# Altium schematic sheet FlexiCan.SchDoc
size A1; SheetNumber: 1; SheetTotal: 1
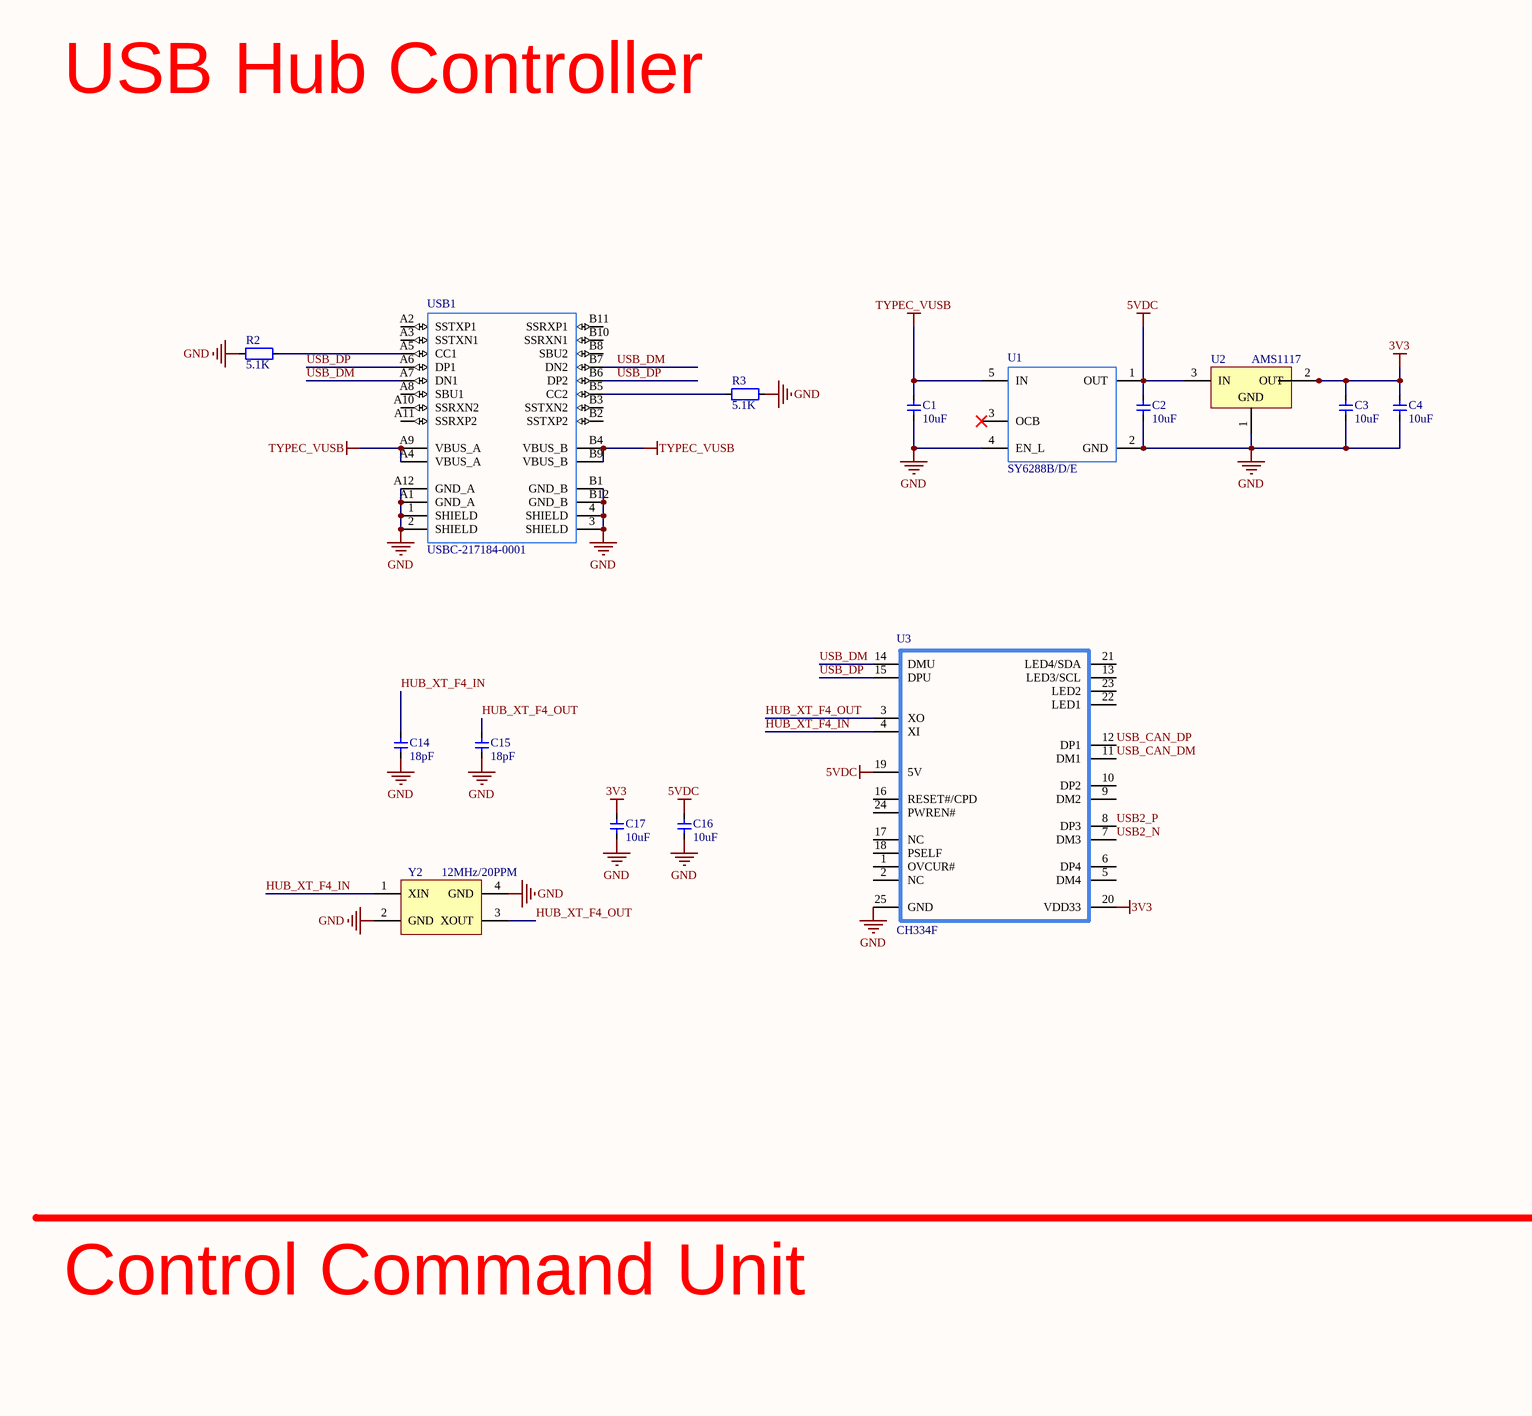
[diagram p0: FlexiCan.SchDoc, top left]
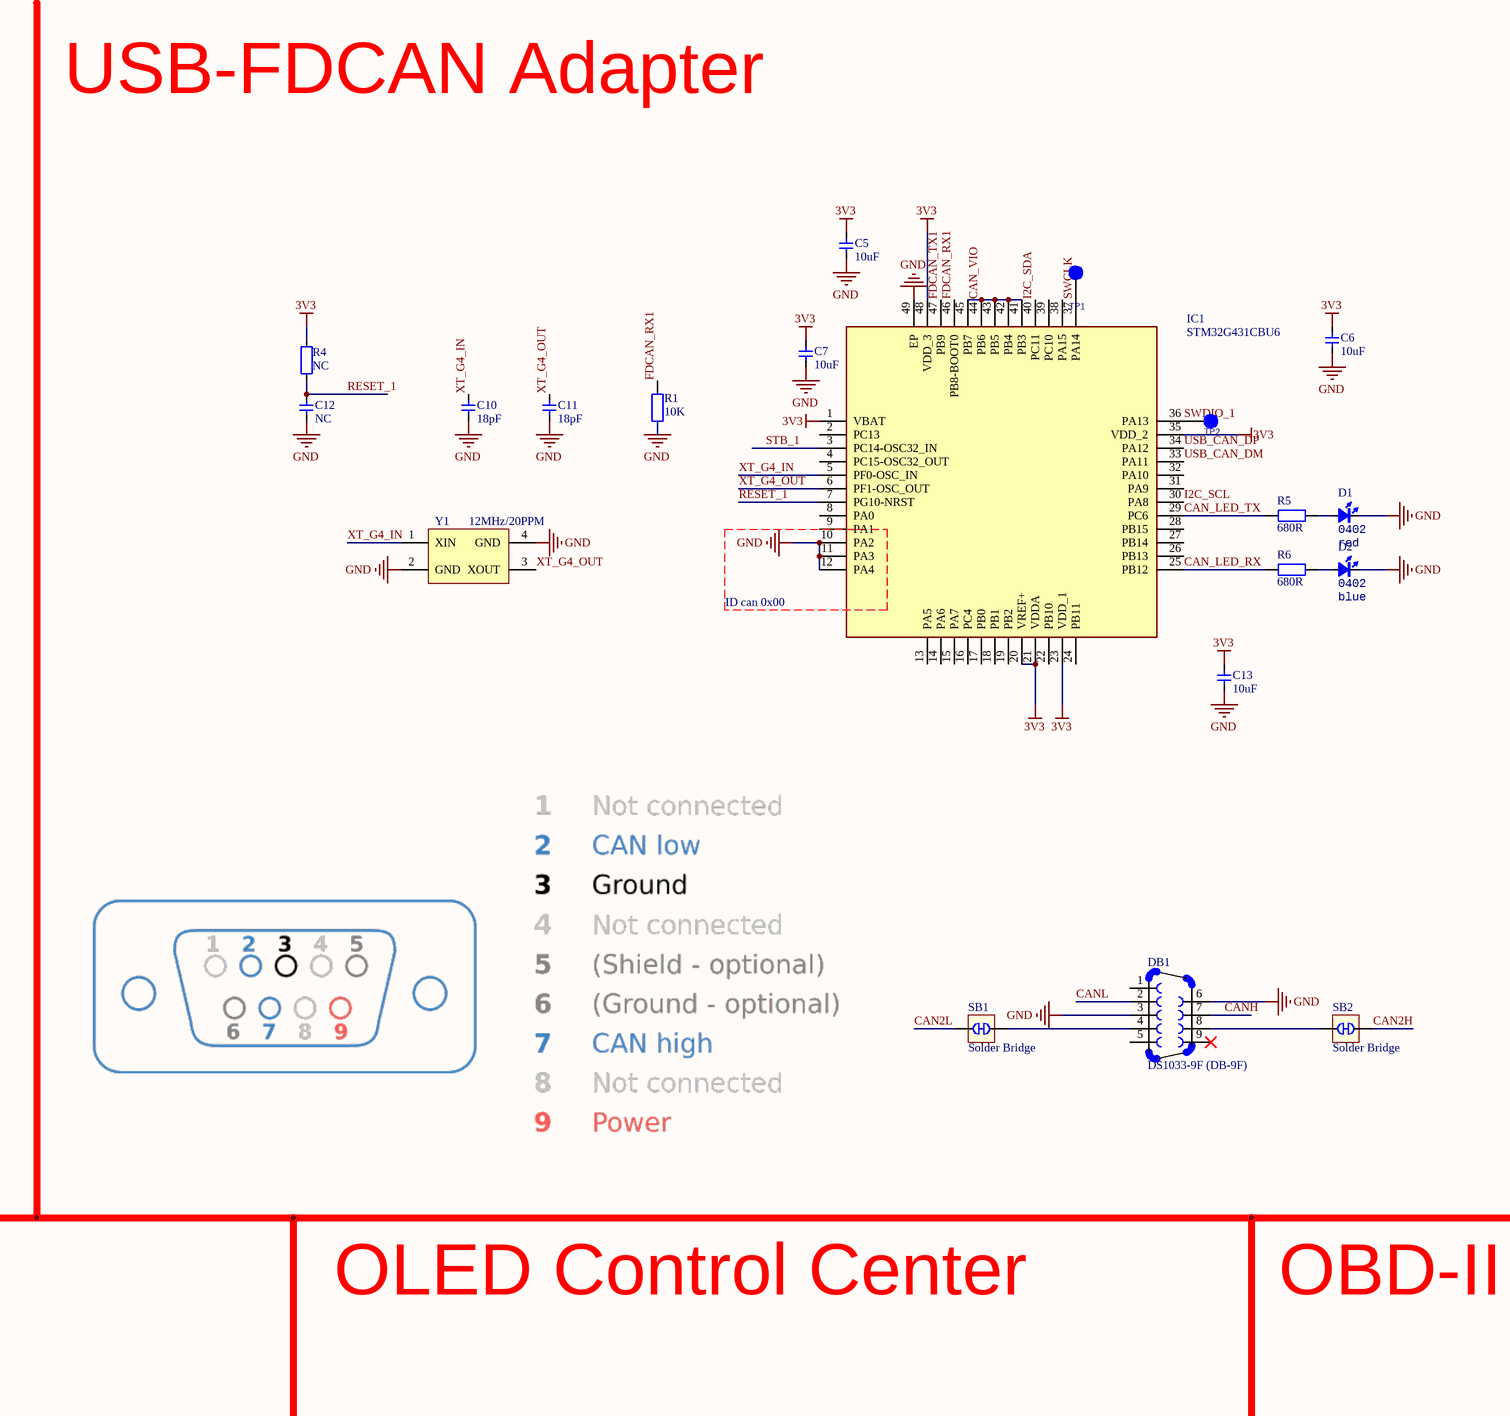
[diagram p1: FlexiCan.SchDoc, top middle]
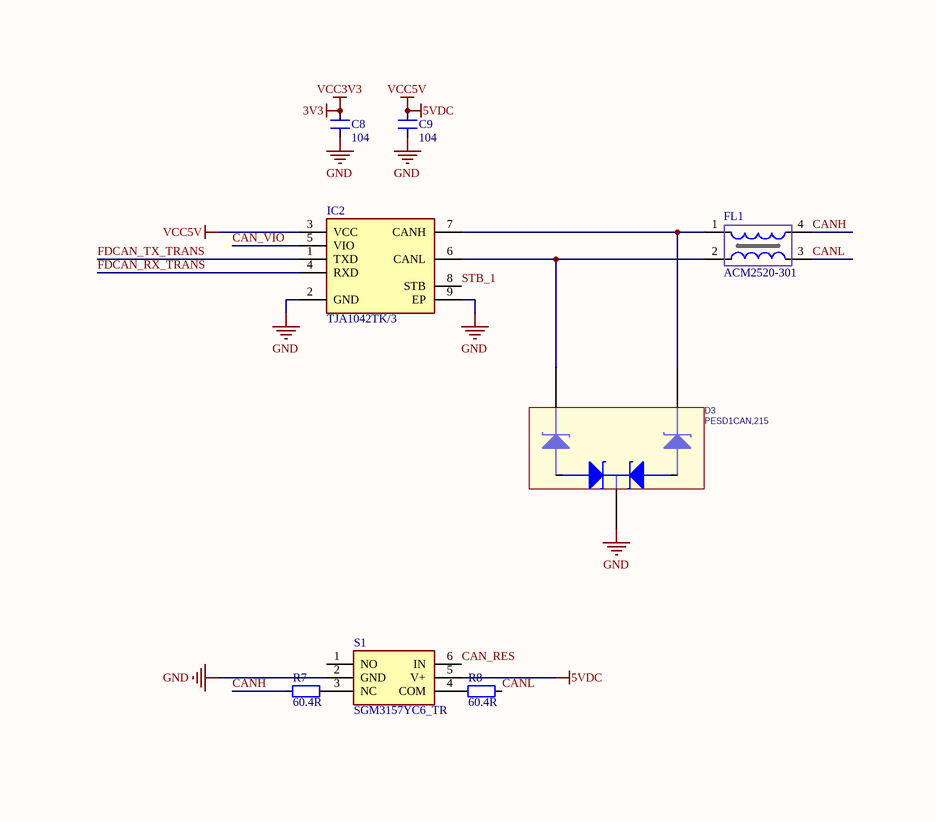
[diagram p2: FlexiCan.SchDoc, top right]
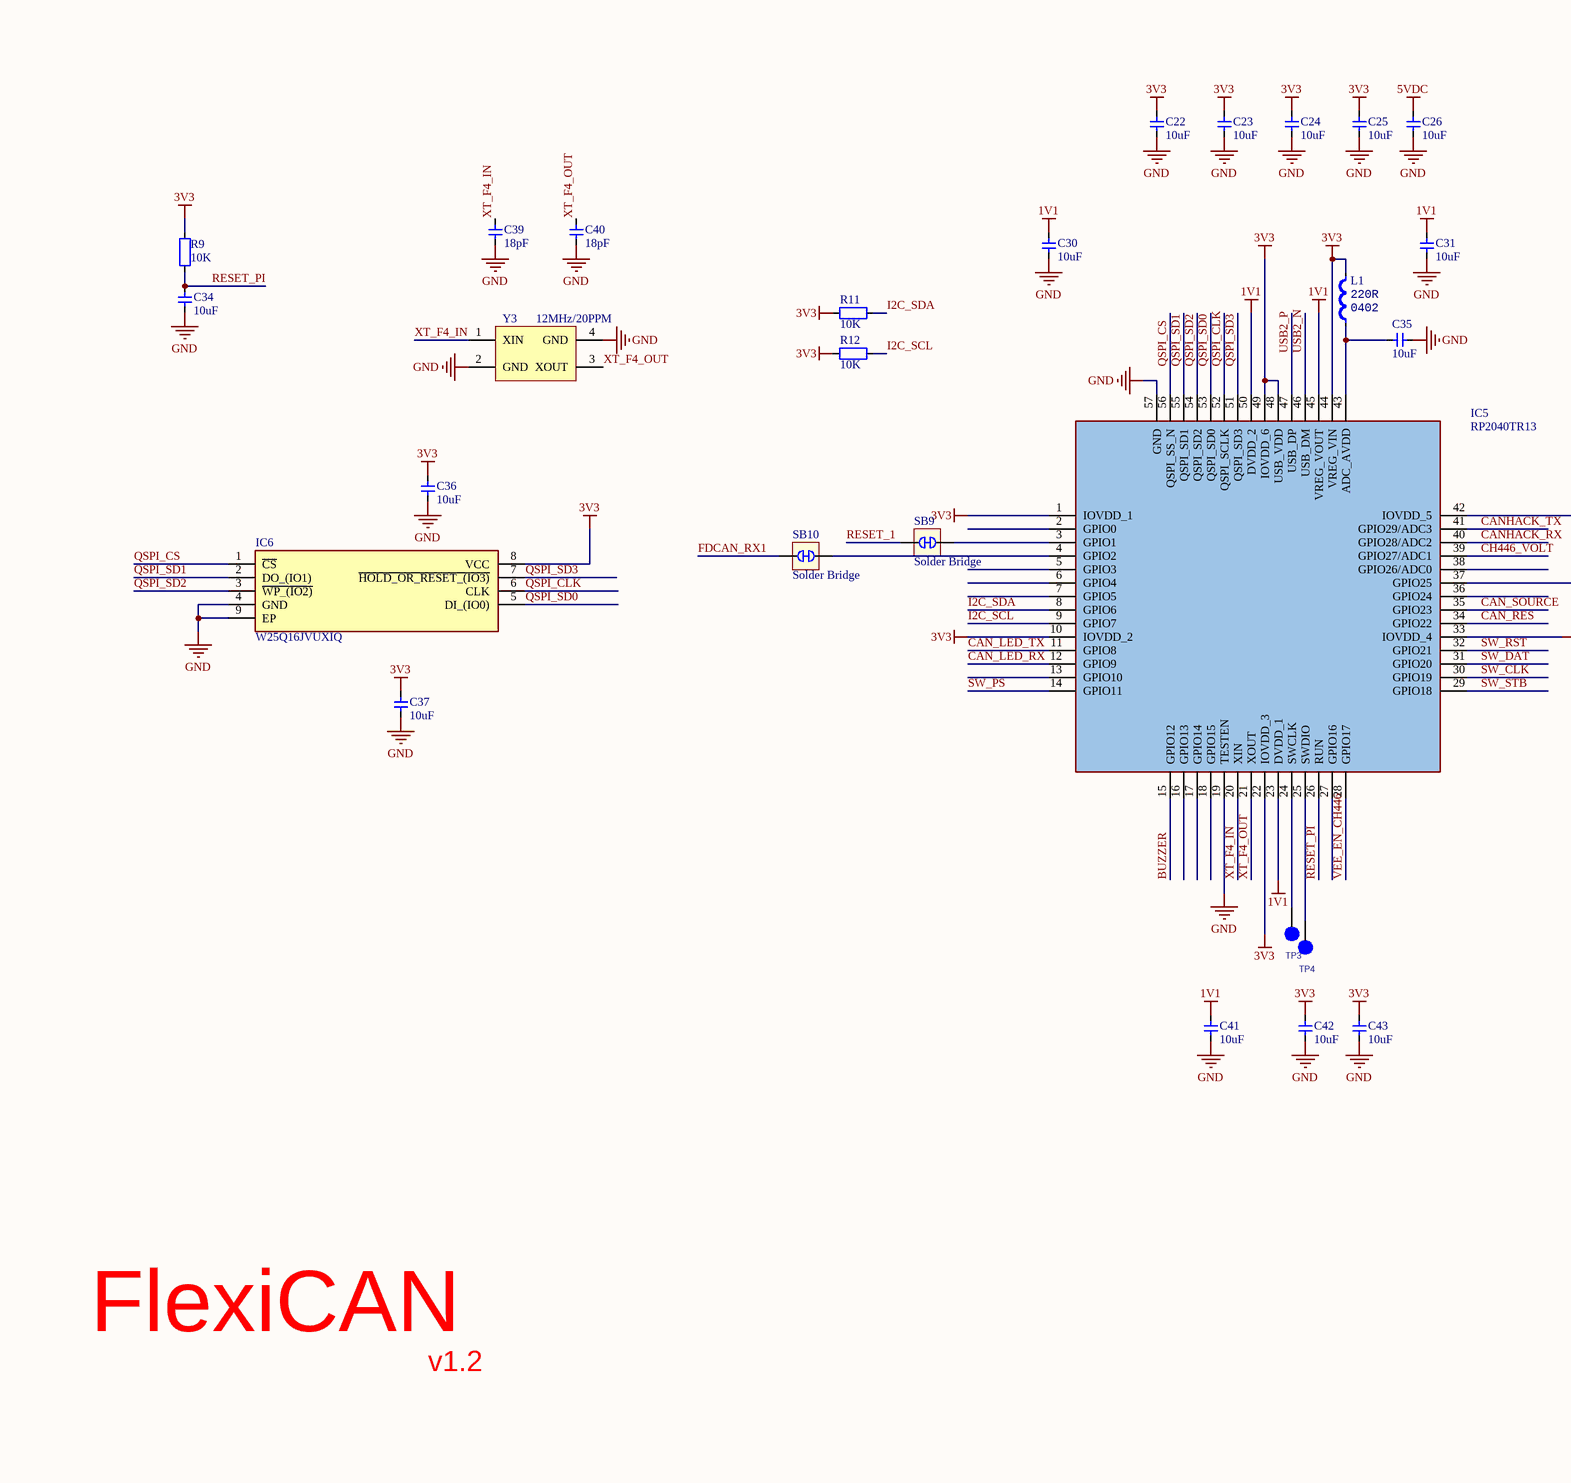
[diagram p3: FlexiCan.SchDoc, bottom left]
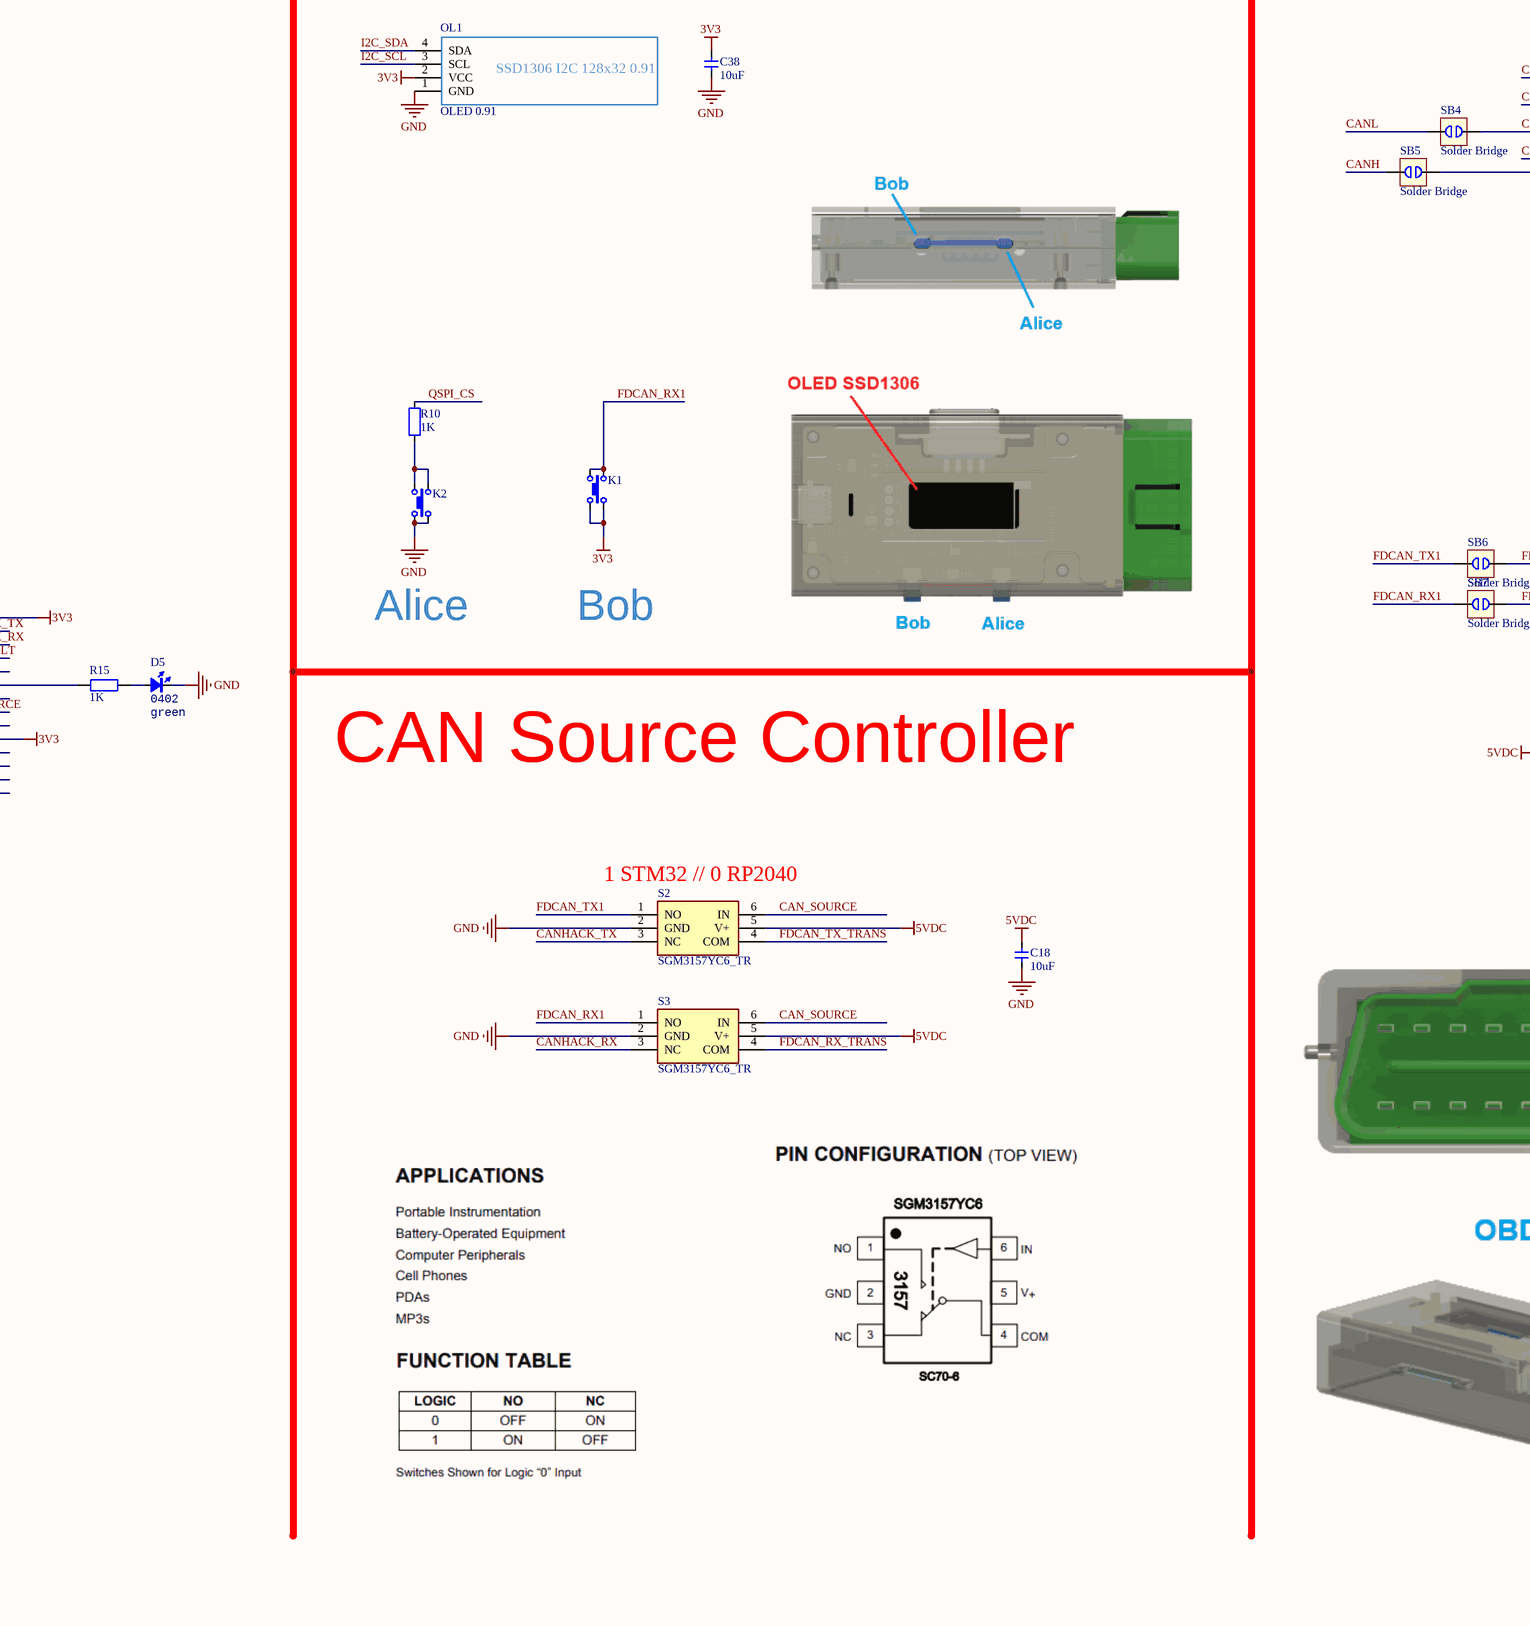
[diagram p4: FlexiCan.SchDoc, bottom middle]
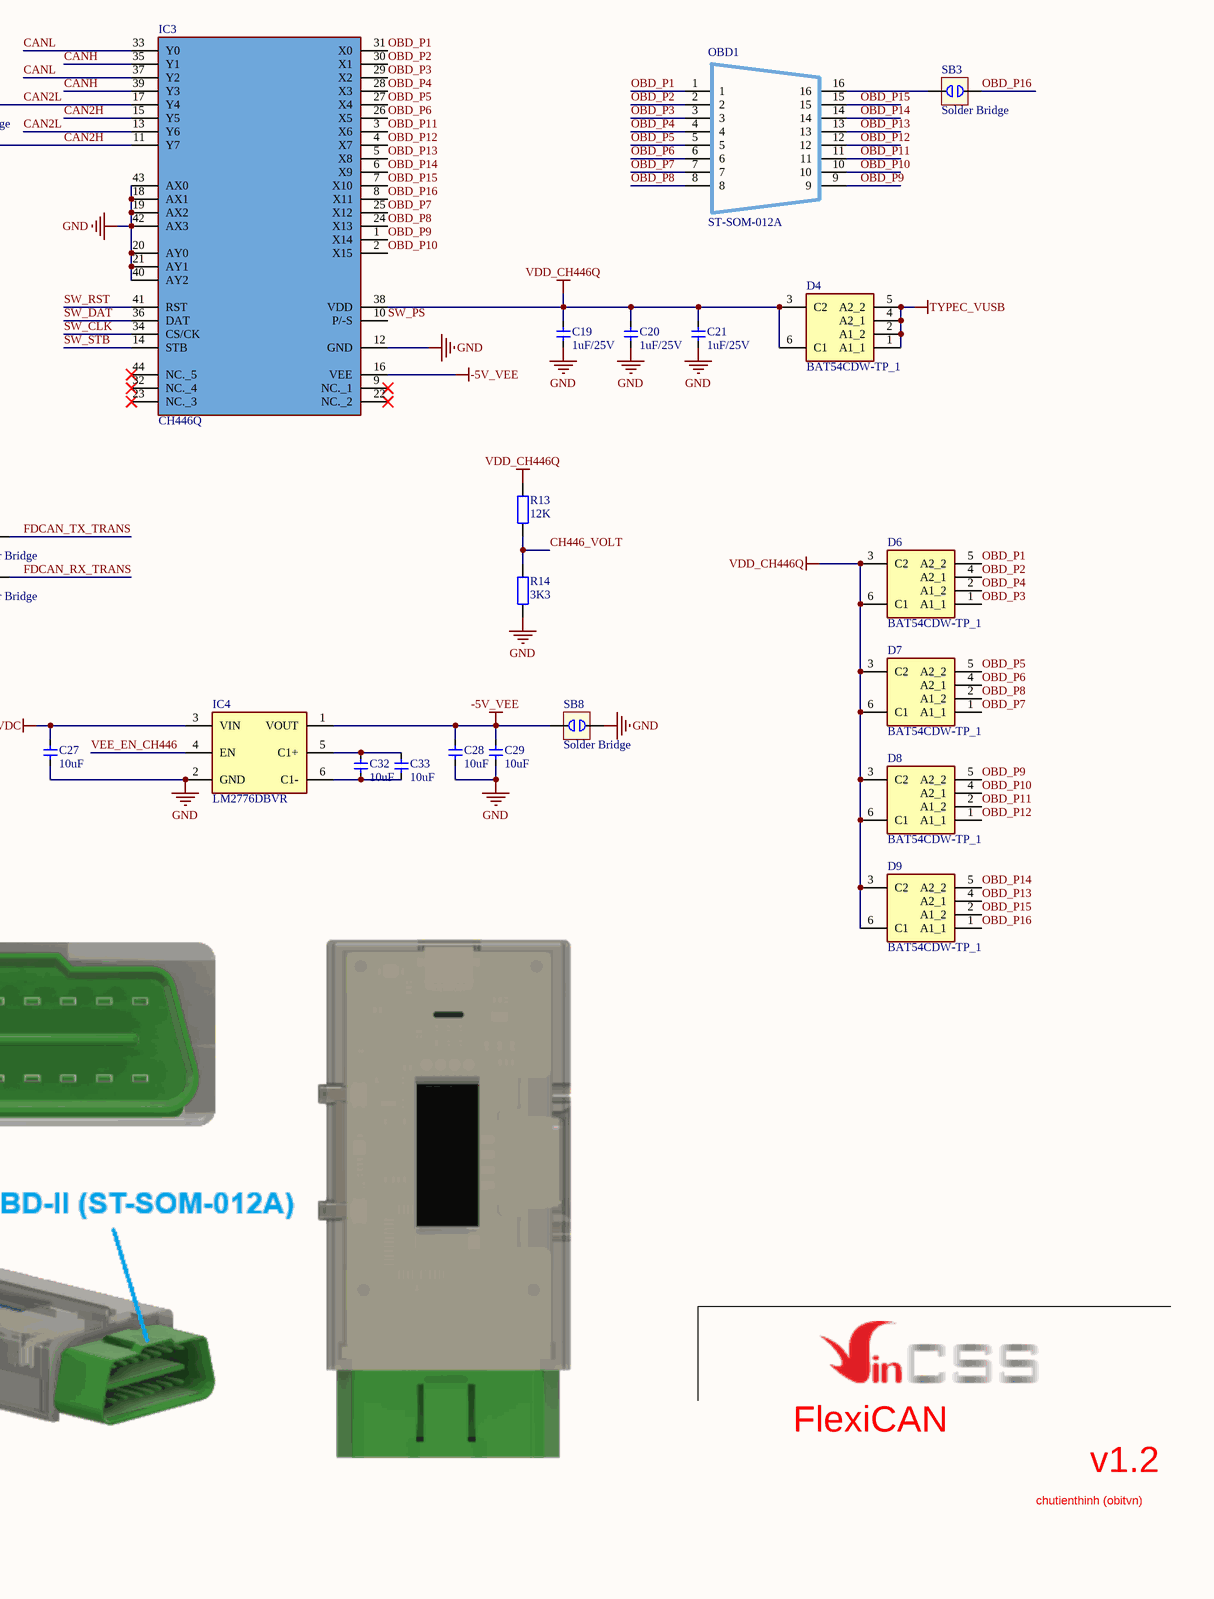
[diagram p5: FlexiCan.SchDoc, bottom right]

## Parts
C1  10uF  [CAP_0402]
C2  10uF  [CAP_0402]
C3  10uF  [CAP_0402]
C4  10uF  [CAP_0402]
C5  10uF  [CAP_0402]
C6  10uF  [CAP_0402]
C7  10uF  [CAP_0402]
C8  104  [CAP_0402]
C9  104  [CAP_0402]
C10  18pF  [CAP_0402]
C11  18pF  [CAP_0402]
C12  NC  [CAP_0402]
C13  10uF  [CAP_0402]
C14  18pF  [CAP_0402]
C15  18pF  [CAP_0402]
C16  10uF  [CAP_0402]
C17  10uF  [CAP_0402]
C18  10uF  [CAP_0402]
C19  1uF/25V  [CAP_0402]
C20  1uF/25V  [CAP_0402]
C21  1uF/25V  [CAP_0402]
C22  10uF  [CAP_0402]
C23  10uF  [CAP_0402]
C24  10uF  [CAP_0402]
C25  10uF  [CAP_0402]
C26  10uF  [CAP_0402]
C27  10uF  [CAP_0402]
C28  10uF  [CAP_0402]
C29  10uF  [CAP_0402]
C30  10uF  [CAP_0402]
C31  10uF  [CAP_0402]
C32  10uF  [CAP_0402]
C33  10uF  [CAP_0402]
C34  10uF  [CAP_0402]
C35  10uF  [CAP_0402]
C36  10uF  [CAP_0402]
C37  10uF  [CAP_0402]
C38  10uF  [CAP_0402]
C39  18pF  [CAP_0402]
C40  18pF  [CAP_0402]
C41  10uF  [CAP_0402]
C42  10uF  [CAP_0402]
C43  10uF  [CAP_0402]
D1  Type: 0402  [LED_0402_RED]  (hidden comment: red)
D2  Type: 0402  [LED_0402_BLUE]  (hidden comment: blue)
D3  PESD1CAN,215  [SOT23-3]
D4  BAT54CDW-TP_1  [SOT65P222X120-6N]
D5  Type: 0402  [LED_0402_GREEN]  (hidden comment: green)
D6  BAT54CDW-TP_1  [SOT65P222X120-6N]
D7  BAT54CDW-TP_1  [SOT65P222X120-6N]
D8  BAT54CDW-TP_1  [SOT65P222X120-6N]
D9  BAT54CDW-TP_1  [SOT65P222X120-6N]
DB1  DS1033-9F (DB-9F)  [DB-9 DS1033-9F]
FL1  ACM2520-301  [ACM25203012P]
IC1  STM32G431CBU6  [QFN50P700X700X65-49N-D]
IC2  TJA1042TK/3  [SON65P300X300X100-9N]
IC3  CH446Q  [QFP80P1350X1350X150-44N]
IC4  LM2776DBVR  [SOT95P280X145-6N]
IC5  RP2040TR13  [RP2040TR13]
IC6  W25Q16JVUXIQ  [SON50P300X200X60-9N]
K1  TACT 4P  [ButtonTACT_3.5*3.55_90]  (value not drawn)
K2  TACT 4P  [ButtonTACT_3.5*3.55_90]  (value not drawn)
L1  value 220R  Type: 0402  [IND_0402Q]  (hidden comment: H0402)
OBD1  ST-SOM-012A  [ST-SOM-012A]
OL1  OLED 0.91  [OLED 0.91 I2C]
R1  10K  [RES_0402]
R2  5.1K  [RES_0402]
R3  5.1K  [RES_0402]
R4  NC  [RES_0402]
R5  680R  [RES_0402]
R6  680R  [RES_0402]
R7  60.4R  [RES_0402]
R8  60.4R  [RES_0402]
R9  10K  [RES_0402]
R10  1K  [RES_0402]
R11  10K  [RES_0402]
R12  10K  [RES_0402]
R13  12K  [RES_0402]
R14  3K3  [RES_0402]
R15  1K  [RES_0402]
S1  SGM3157YC6_TR  [SOT65P230X110-6N]
S2  SGM3157YC6_TR  [SOT65P230X110-6N]
S3  SGM3157YC6_TR  [SOT65P230X110-6N]
SB1  Solder Bridge  [SB2_NC]  (no BOM)
SB2  Solder Bridge  [SB2_NC]  (no BOM)
SB3  Solder Bridge  [SB2_NO]  (no BOM)
SB4  Solder Bridge  [SB2_NO]  (no BOM)
SB5  Solder Bridge  [SB2_NO]  (no BOM)
SB6  Solder Bridge  [SB2_NO]  (no BOM)
SB7  Solder Bridge  [SB2_NO]  (no BOM)
SB8  Solder Bridge  [SB2_NO]  (no BOM)
SB9  Solder Bridge  [SB2_NC]  (no BOM)
SB10  Solder Bridge  [SB2_NC]  (no BOM)
TP1  TP 1mm  [SMT Test Point]  (value not drawn)  (no BOM)
TP2  TP 1mm  [SMT Test Point]  (value not drawn)  (no BOM)
TP3  TP 1mm  [SMT Test Point]  (value not drawn)  (no BOM)
TP4  TP 1mm  [SMT Test Point]  (value not drawn)  (no BOM)
U1  SY6288B/D/E  [SOT95P285X130-5N]
U2  AMS1117  [SOT223]
U3  CH334F  [QFN50P400X400X80-25N-D]
USB1  USBC-217184-0001  [Molex_217184-0001]
Y1  12MHz/20PPM  [XT-2520]
Y2  12MHz/20PPM  [XT-2520]
Y3  12MHz/20PPM  [XT-2520]

## Nets
1V1: C30.2 C31.2 C41.2 IC5.23(DVDD_1) IC5.45(VREG_VOUT) IC5.50(DVDD_2)
3V3: C3.2 C4.2 C5.2 C6.2 C7.2 C8.1 C13.2 C17.2 C22.2 C23.2 C24.2 C25.2 C36.1 C37.2 C38.2 C42.2 C43.2 IC1.1(VBAT) IC1.20(VREF+) IC1.21(VDDA) IC1.23(VDD_1) IC1.35(VDD_2) IC1.48(VDD_3) IC5.1(IOVDD_1) IC5.10(IOVDD_2) IC5.22(IOVDD_3) IC5.33(IOVDD_4) IC5.42(IOVDD_5) IC5.44(VREG_VIN) IC5.48(USB_VDD) IC5.49(IOVDD_6) IC6.8(VCC) K1.1 K1.3 L1.2 OL1.2(VCC) R4.2 R9.2 R11.2 R12.2 U2.2(OUT) U2.4 U3.20(VDD33)  [also labelled VCC3V3]
5VDC: C2.2 C9.1 C16.2 C18.2 C26.2 C27.2 IC2.3(VCC) IC4.3(VIN) S1.5(V+) S2.5(V+) S3.5(V+) U1.1(OUT) U2.3(IN) U3.19(5V)  [also labelled VCC5V]
-5V_VEE: C28.2 C29.2 IC3.16(VEE) IC4.1(VOUT) SB8.1
GND: C1.1 C2.1 C3.1 C4.1 C5.1 C6.1 C7.1 C8.2 C9.2 C10.1 C11.1 C12.1 C13.1 C14.1 C15.1 C16.1 C17.1 C18.1 C19.1 C20.1 C21.1 C22.1 C23.1 C24.1 C25.1 C26.1 C27.1 C28.1 C29.1 C30.1 C31.1 C34.1 C35.1 C36.2 C37.1 C38.1 C39.1 C40.1 C41.1 C42.1 C43.1 D1.2(K) D2.2(K) D3.3(DK) D5.2(K) DB1.3 DB1.6 IC1.10(PA2) IC1.11(PA3) IC1.12(PA4) IC1.49(EP) IC2.2(GND) IC2.9(EP) IC3.12(GND) IC3.18(AX1) IC3.19(AX2) IC3.20(AY0) IC3.21(AY1) IC3.40(AY2) IC3.42(AX3) IC3.43(AX0) IC4.2(GND) IC5.19(TESTEN) IC5.57(GND) IC6.4(GND) IC6.9(EP) K2.1 K2.3 OL1.1(GND) R1.1 R2.1 R3.1 R14.1 S1.2(GND) S2.2(GND) S3.2(GND) SB8.2 U1.2(GND) U1.4(EN_L) U2.1(GND) U3.25(GND) USB1.1(SHIELD) USB1.2(SHIELD) USB1.3(SHIELD) USB1.4(SHIELD) USB1.A1(GND_A) USB1.A12(GND_A) USB1.B1(GND_B) USB1.B12(GND_B) Y1.2(GND) Y1.4(GND) Y2.2(GND) Y2.4(GND) Y3.2(GND) Y3.4(GND)
TYPEC_VUSB: C1.2 D4.1(A1_1) D4.2(A1_2) D4.4(A2_1) D4.5(A2_2) U1.5(IN) USB1.A4(VBUS_A) USB1.A9(VBUS_A) USB1.B4(VBUS_B) USB1.B9(VBUS_B)
VDD_CH446Q: C19.2 C20.2 C21.2 D4.3(C2) D4.6(C1) D6.3(C2) D6.6(C1) D7.3(C2) D7.6(C1) D8.3(C2) D8.6(C1) D9.3(C2) D9.6(C1) IC3.38(VDD) R13.2
BUZZER: IC5.15(GPIO12)
CAN2H: IC3.11(Y7) IC3.15(Y5) SB2.2 SB5.2
CAN2L: IC3.13(Y6) IC3.17(Y4) SB1.1 SB4.2
CAN_LED_RX: IC1.25(PB12) IC5.12(GPIO9) R6.1
CAN_LED_TX: IC1.29(PC6) IC5.11(GPIO8) R5.1
CAN_RES: IC5.34(GPIO22) S1.6(IN)
CAN_SOURCE: IC5.35(GPIO23) S2.6(IN) S3.6(IN)
CAN_VIO: IC1.41(PB3) IC1.42(PB4) IC1.43(PB5) IC1.44(PB6) IC1.45(PB7) IC2.5(VIO)
CANH: DB1.7 FL1.4 IC3.35(Y1) IC3.39(Y3) R7.1 SB5.1
CANHACK_RX: IC5.40(GPIO28/ADC2) S3.3(NC)
CANHACK_TX: IC5.41(GPIO29/ADC3) S2.3(NC)
CANL: DB1.2 FL1.3 IC3.33(Y0) IC3.37(Y2) R8.2 SB4.1
CH446_VOLT: IC5.39(GPIO27/ADC1) R13.1 R14.2
FDCAN_RX1: IC1.46(PB8-BOOT0) K1.2 K1.4 R1.2 S3.1(NO) SB7.1 SB10.1
FDCAN_RX_TRANS: IC2.4(RXD) S3.4(COM) SB7.2
FDCAN_TX1: IC1.47(PB9) S2.1(NO) SB6.1
FDCAN_TX_TRANS: IC2.1(TXD) S2.4(COM) SB6.2
HUB_XT_F4_IN: C14.2 U3.4(XI) Y2.1(XIN)
HUB_XT_F4_OUT: C15.2 U3.3(XO) Y2.3(XOUT)
I2C_SCL: IC1.30(PA8) IC5.9(GPIO7) OL1.3(SCL) R12.1
I2C_SDA: IC1.40(PC11) IC5.8(GPIO6) OL1.4(SDA) R11.1
OBD_P1: D6.5(A2_2) IC3.31(X0) OBD1.1
OBD_P2: D6.4(A2_1) IC3.30(X1) OBD1.2
OBD_P3: D6.1(A1_1) IC3.29(X2) OBD1.3
OBD_P4: D6.2(A1_2) IC3.28(X3) OBD1.4
OBD_P5: D7.5(A2_2) IC3.27(X4) OBD1.5
OBD_P6: D7.4(A2_1) IC3.26(X5) OBD1.6
OBD_P7: D7.1(A1_1) IC3.25(X12) OBD1.7
OBD_P8: D7.2(A1_2) IC3.24(X13) OBD1.8
OBD_P9: D8.5(A2_2) IC3.1(X14) OBD1.9
OBD_P10: D8.4(A2_1) IC3.2(X15) OBD1.10
OBD_P11: D8.2(A1_2) IC3.3(X6) OBD1.11
OBD_P12: D8.1(A1_1) IC3.4(X7) OBD1.12
OBD_P13: D9.4(A2_1) IC3.5(X8) OBD1.13
OBD_P14: D9.5(A2_2) IC3.6(X9) OBD1.14
OBD_P15: D9.2(A1_2) IC3.7(X10) OBD1.15
OBD_P16: D9.1(A1_1) IC3.8(X11) SB3.2
QSPI_CLK: IC5.52(QSPI_SCLK) IC6.6(CLK)
QSPI_CS: IC5.56(QSPI_SS_N) IC6.1(~{CS}) R10.1
QSPI_SD0: IC5.53(QSPI_SD0) IC6.5(DI_(IO0))
QSPI_SD1: IC5.55(QSPI_SD1) IC6.2(DO_(IO1))
QSPI_SD2: IC5.54(QSPI_SD2) IC6.3(~{WP_(IO2)})
QSPI_SD3: IC5.51(QSPI_SD3) IC6.7(~{HOLD_OR_RESET_(IO3)})
RESET_1: C12.2 IC1.7(PG10-NRST) R4.1 SB9.1
RESET_PI: C34.2 IC5.26(RUN) R9.1
STB_1: IC1.3(PC14-OSC32_IN) IC2.8(STB)
SW_CLK: IC3.34(CS/CK) IC5.30(GPIO19)
SW_DAT: IC3.36(DAT) IC5.31(GPIO20)
SW_PS: IC3.10(P/-S) IC5.14(GPIO11)
SW_RST: IC3.41(RST) IC5.32(GPIO21)
SW_STB: IC3.14(STB) IC5.29(GPIO18)
SWCLK: IC1.37(PA14) TP1.1(TP)
SWDIO_1: IC1.36(PA13) TP2.1(TP)
USB2_N: IC5.46(USB_DM) U3.7(DM3)
USB2_P: IC5.47(USB_DP) U3.8(DP3)
USB_CAN_DM: IC1.33(PA11) U3.11(DM1)
USB_CAN_DP: IC1.34(PA12) U3.12(DP1)
USB_DM: U3.14(DMU) USB1.A7(DN1) USB1.B7(DN2)
USB_DP: U3.15(DPU) USB1.A6(DP1) USB1.B6(DP2)
VEE_EN_CH446: IC4.4(EN) IC5.28(GPIO17)
XT_F4_IN: C39.2 IC5.20(XIN) Y3.1(XIN)
XT_F4_OUT: C40.2 IC5.21(XOUT) Y3.3(XOUT)
XT_G4_IN: C10.2 IC1.5(PF0-OSC_IN) Y1.1(XIN)
XT_G4_OUT: C11.2 IC1.6(PF1-OSC_OUT) Y1.3(XOUT)
NetC32_1: C32.1 C33.1 IC4.6(C1-)
NetC32_2: C32.2 C33.2 IC4.5(C1+)
NetC35_2: C35.2 IC5.43(ADC_AVDD) L1.1
NetD1_1: D1.1(A) R5.2
NetD2_1: D2.1(A) R6.2
NetD3_1: D3.1(K1) FL1.1 IC2.7(CANH)
NetD3_2: D3.2(K2) FL1.2 IC2.6(CANL)
NetD5_1: D5.1(A) R15.2
NetDB1_4: DB1.4 SB1.2
NetDB1_8: DB1.8 SB2.1
NetIC5_3: IC5.3(GPIO1) SB9.2
NetIC5_4: IC5.4(GPIO2) SB10.2
NetIC5_24: IC5.24(SWCLK) TP3.1(TP)
NetIC5_25: IC5.25(SWDIO) TP4.1(TP)
NetIC5_37: IC5.37(GPIO25) R15.1
NetK2_2: K2.2 K2.4 R10.2
NetOBD1_16: OBD1.16 SB3.1
NetR2_2: R2.2 USB1.A5(CC1)
NetR3_2: R3.2 USB1.B5(CC2)
NetR7_2: R7.2 S1.3(NC)
NetR8_1: R8.1 S1.4(COM)

Not connected (* = marked no-connect by the designer): DB1 1 5 9*; IC1 2(PC13) 4(PC15-OSC32_OUT) 8(PA0) 9(PA1) 13(PA5) 14(PA6) 15(PA7) 16(PC4) 17(PB0) 18(PB1) 19(PB2) 22(PB10) 24(PB11) 26(PB13) 27(PB14) 28(PB15) 31(PA9) 32(PA10) 38(PA15) 39(PC10); IC3 9(NC._1)* 22(NC._2)* 23(NC._3)* 32(NC._4)* 44(NC._5)*; IC5 2(GPIO0) 5(GPIO3) 6(GPIO4) 7(GPIO5) 13(GPIO10) 16(GPIO13) 17(GPIO14) 18(GPIO15) 27(GPIO16) 36(GPIO24) 38(GPIO26/ADC0); S1 1(NO); U1 3(OCB)*; U3 1(OVCUR#) 2(NC) 5(DM4) 6(DP4) 9(DM2) 10(DP2) 13(LED3/SCL) 16(RESET#/CPD) 17(NC) 18(PSELF) 21(LED4/SDA) 22(LED1) 23(LED2) 24(PWREN#); USB1 A2(SSTXP1) A3(SSTXN1) A8(SBU1) A10(SSRXN2) A11(SSRXP2) B2(SSTXP2) B3(SSTXN2) B8(SBU2) B10(SSRXN1) B11(SSRXP1)

## Notes on the sheet
- USB Hub Controller
- USB-FDCAN Adapter
- ID can 0x00
- Control Command Unit
- OLED Control Center
- OBD-II Path Selector
- Alice
- Bob
- CAN Source Controller
- (near S2) 1 STM32 // 0 RP2040
- FlexiCAN
- v1.2
- chutienthinh (obitvn)
- (in symbol OLED 0.91 128*32) SSD1306 I2C 128x32 0.91

## Library data of the parts
C1-C7 C10-C43 = C_0402: Capacitor; Value: 0.1u
C8 C9 = CM: Cap SMD; Value: 103
D1 D2 D5 = LED_0402: LED
  D1: Value: red
  D2: Value: blue
  D5: Value: green
D3 = PESD5V0S2BT,215: TVS DIODE 5V 14V SOT23; Manufacturer: Nexperia USA Inc.; Manufacturer part #: PESD5V0S2BT,215; Indications: *; Created by: eteofilo; Creation date: 17-Apr-2018; Value: *; Modified by: *
D4 D6-D9 = BAT54CDW-TP_1: Schottky Diode; Manufacturer_Name: MCC; Datasheet Link: https://www.mccsemi.com/pdf/Products/BAT54CDW(SOT-363).pdf; Height: 1.2mm; Manufacturer_Part_Number: BAT54CDW-TP; Mouser Part Number: 833-BAT54CDW-TP; Mouser Price/Stock: https://www.mouser.co.uk/ProductDetail/Micro-Commercial-Components-MCC/BAT54CDW-TP/?qs=O2qRfqcg9D8JitxPtsrWSg%3D%3D; Arrow Part Number: BAT54CDW-TP; Arrow Price/Stock: https://www.arrow.com/en/products/bat54cdw-tp/micro-commercial-components
DB1 = DB9-F: DS1033-9F (DB-9F) Female
FL1 = ACM2520-301-2PL-TL01_1: Common Mode Filters; Manufacturer_Name: TDK; Manufacturer_Part_Number: ACM9070-701-2PL-TL01; Datasheet Link: http://www.mouser.com/ds/2/400/e9713_acm-16715.pdf; Height: 4.5mm; Mouser Part Number: 810-ACM90707012PLTL; Mouser Price/Stock: https://www.mouser.co.uk/ProductDetail/TDK/ACM9070-701-2PL-TL01?qs=vGA93s6UehfkQlsVzBqdDg%3D%3D; Arrow Part Number: ACM9070-701-2PL-TL01; Arrow Price/Stock: https://www.arrow.com/en/products/acm9070-701-2pl-tl01/tdk
IC1 = STM32G431CBU6: Integrated Circuit; Manufacturer_Name: STMicroelectronics; Datasheet Link: https://www.st.com/resource/en/datasheet/stm32g431cb.pdf; Height: 0.65mm; Manufacturer_Part_Number: STM32G431CBU6; Mouser Part Number: 511-STM32G431CBU6; Mouser Price/Stock: https://www.mouser.co.uk/ProductDetail/STMicroelectronics/STM32G431CBU6?qs=T3oQrply3y%252B0hTuSHQ7oqA%3D%3D; Arrow Part Number: STM32G431CBU6; Arrow Price/Stock: https://www.arrow.com/en/products/stm32g431cbu6/stmicroelectronics?region=nac
IC2 = SIT1044QTK/3: https://item.taobao.com/item.htm?spm=a21n57.1.0.0.730f50e55xYJuK&id=715328337189&ns=1&abbucket=13#detail; Manufacturer_Name: NXP; Manufacturer_Part_Number: TJA1044VTKZ; Datasheet Link: http://www.nxp.com/docs/en/data-sheet/TJA1044V.pdf; Height: 1mm; Mouser Part Number: 771-TJA1044VTKZ; Mouser Price/Stock: https://www.mouser.co.uk/ProductDetail/NXP-Semiconductors/TJA1044VTKZ?qs=wUXugUrL1qx6DvcsX%252BFKdw%3D%3D; Arrow Part Number: TJA1044VTKZ; Arrow Price/Stock: https://www.arrow.com/en/products/tja1044vtkz/nxp-semiconductors?region=nac
IC3 = CH446Q: Integrated Circuit; Manufacturer_Name: WCH; Datasheet Link: https://www.wch-ic.com/downloads/file/133.html?time=2024-02-26%2022:42:14&code=TqfNujBDGjF109JnJMuaEY51vRDXux8eMvS4ANAZ; Height: 1.5mm; Manufacturer_Part_Number: CH446Q
IC4 = LM2776DBVR: Integrated Circuit; Manufacturer_Name: Texas Instruments; Datasheet Link: http://www.ti.com/lit/gpn/lm2776; Height: 1.45mm; Manufacturer_Part_Number: LM2776DBVR; Mouser Part Number: 595-LM2776DBVR; Mouser Price/Stock: https://www.mouser.co.uk/ProductDetail/Texas-Instruments/LM2776DBVR?qs=GJ%2F2ZGcr5uNWFBSWrQXDWw%3D%3D; Arrow Part Number: LM2776DBVR; Arrow Price/Stock: https://www.arrow.com/en/products/lm2776dbvr/texas-instruments?region=nac
IC5 = RP2040TR13: Integrated Circuit; Manufacturer_Name: RASPBERRY-PI; Datasheet Link: https://www.farnell.com/datasheets/3213406.pdf; Height: 0.9mm; Manufacturer_Part_Number: RP2040TR13
IC6 = W25Q16JVUXIQ: Integrated Circuit; Manufacturer_Name: Winbond; Datasheet Link: https://www.winbond.com/hq/search-resource-file.jsp?partNo=W25Q16JVUXIQ&type=datasheet; Height: 0.6mm; Manufacturer_Part_Number: W25Q16JVUXIQ
K1 K2 = ButtonTACT: Button; value: 3.4x3.5; type: TACT 4P
L1 = Ind_0402: Inductor; Specification: ±5% 100mA; Manufacturer: *
OBD1 = ST-SOM-012A: ST-SOM-012A OBD II Connector
OL1 = OLED 0.91 128*32: HS HS91L02W2C01 / SSD1306 I2C 128x32 0.91 - Organic Light Emitting Diode Display Screen ROHS
R1 R5 R6 R13-R15 = R: Resistor R1/4W
R2-R4 R7-R12 = R-0402: Resistor; Value: 22R
S1-S3 = SGM3157YC6_TR: Switch; Manufacturer_Name: SGMICRO; Manufacturer_Part_Number: SGM3157YC6/TR; Datasheet Link: https://pdf1.alldatasheet.com/datasheet-pdf/view/224033/SGMICRO/SGM3157YC6/TR.html; Height: 1.1mm
SB1 SB2 SB9 SB10 = SB 2 NC: Solder Bridge 2; Solder: Not Fill; Value: Solder Bridge
SB3-SB8 = SB 2 NO: Solder Bridge 2; Solder: Not Fill; Value: Solder Bridge
TP1-TP4 = TP 1mm: PCB TEST POINT SMT 1mm; Manufacturer part #: *; DigiKey: *; Indications: *; Value: *; Modified by: *; Manufacturer: *; Created by: gmoreno; Creation date: 26-Apr-2012
U1 = SY6288_EN_L: SY6288B/D/E Active Low
U2 = AMS117
U3 = CH334F: CH334F Hub USB / C5187527; JLCPCB Part #: C5187527
USB1 = USBC-217184-0001: USB-C (USB TYPE-C) USB 3.2 Gen 2 (USB 3.1 Gen 2, Superspeed + (USB 3.1)) Receptacle Connector 24 Position Surface Mount, Right Angle; Through Hole; MP: USB4080-03-A; MF: Global Connector Technology; Package: None; Check_prices: https://www.snapeda.com/parts/USB4080-03-A/Global+Connector+Technology/view-part/?ref=eda; Value: *; Availability: In Stock; SnapEDA_Link: https://www.snapeda.com/parts/USB4080-03-A/Global+Connector+Technology/view-part/?ref=snap; Purchase-URL: https://pricing.snapeda.com/search/part/USB4080-03-A/?ref=eda; Price: None
Y1-Y3 = XT-4Pin: XT-2520; MF: ECS International; MP: ECS-3225S30-240-EN-TR; Package: SMD-6 ECS International; Price: 0.75 USD; Availability: Unavailable; Value: *